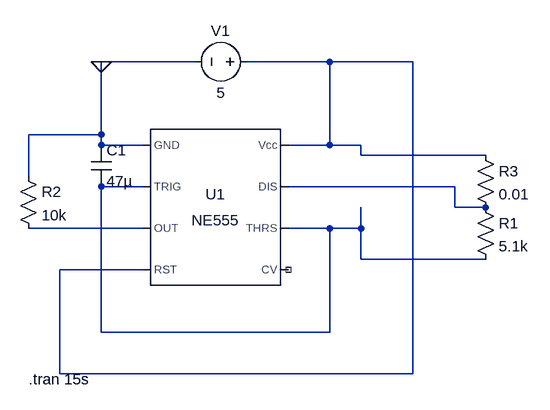
[diagram p0: schematic Draft2.asc]
Draft2.asc, the LTspice schematic file:
Version 4
SHEET 1 880 680
WIRE 192 -64 48 -64
WIRE 400 -64 272 -64
WIRE 528 -64 400 -64
WIRE 48 48 48 -64
WIRE 48 48 -64 48
WIRE 48 64 48 48
WIRE 112 64 48 64
WIRE 400 64 400 -64
WIRE 400 64 336 64
WIRE 448 64 400 64
WIRE 448 80 448 64
WIRE 640 80 448 80
WIRE -64 112 -64 48
WIRE 112 128 48 128
WIRE 592 128 336 128
WIRE 592 160 592 128
WIRE 640 160 592 160
WIRE 112 192 -64 192
WIRE 400 192 336 192
WIRE 448 192 448 160
WIRE 448 192 400 192
WIRE 448 240 448 192
WIRE 640 240 448 240
WIRE 112 256 -16 256
WIRE 48 352 48 128
WIRE 400 352 400 192
WIRE 400 352 48 352
WIRE -16 416 -16 256
WIRE 528 416 528 -64
WIRE 528 416 -16 416
FLAG 48 -64 0
DATAFLAG -32 192 ""
SYMBOL Misc\\NE555 224 160 R0
SYMATTR InstName U1
SYMBOL voltage 288 -64 R90
WINDOW 0 -32 56 VBottom 2
WINDOW 3 32 56 VTop 2
WINDOW 123 0 0 Left 0
WINDOW 39 0 0 Left 0
SYMATTR InstName V1
SYMATTR Value 5
SYMBOL res 624 144 R0
SYMATTR InstName R1
SYMATTR Value 5.1k
SYMBOL cap 32 64 R0
SYMATTR InstName C1
SYMATTR Value 47µ
SYMBOL res -80 96 R0
SYMATTR InstName R2
SYMATTR Value 10k
SYMBOL res 624 64 R0
SYMATTR InstName R3
SYMATTR Value 0.01
TEXT -64 424 Left 2 !.tran 15s

The netlist it stands for:
* Draft2.asc
XU1 0 N002 N004 N001 NC_01 N002 N003 N001 NE555  ; pins GND TRIG OUT RST CV THRS DIS Vcc
V1 N001 0 5
R1 N003 N002 5.1k
C1 0 N002 47µ
R2 0 N004 10k
R3 N001 N003 0.01
.tran 15s
.lib NE555.sub
.backanno
.end